# Altium project STM8L151K-EVAL.PrjPcb
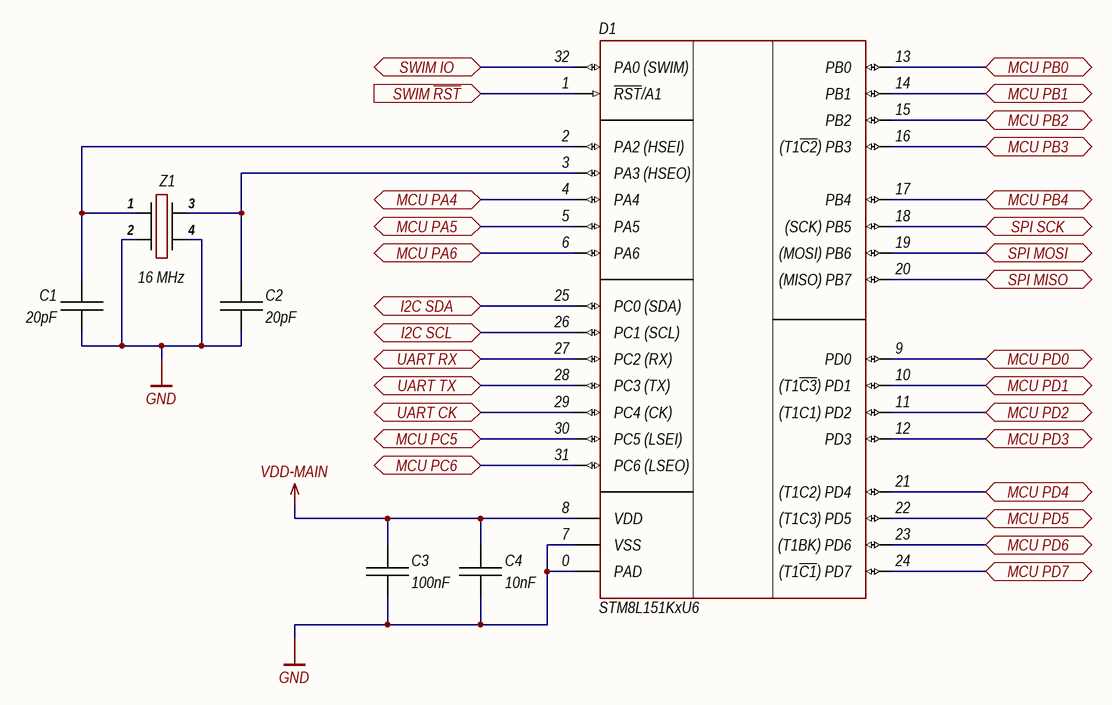
[diagram p0: MCU.SchDoc]
ProjectTitle: Evaluation board for MCU STM8L151; ProjectShortDate: 2019.02; ProjectRevision: 201; ProjectNumber: STM8L151K-EVAL; ProjectDate: 01.02.2019; ProjectCompanyName: Azek Clark © 2021; ProjectAuthor: Clark A.
7 sheets, 28 parts. Net scope: flat (ports and power ports of the same name join across sheets).
Board file: PCB.PcbDoc
Sheets:
  MCU.SchDoc
  Connector-side-1.SchDoc
  Connector-side-2.SchDoc
  Connector-side-3.SchDoc
  Connector-SWIM.SchDoc
  Board-user.SchDoc
  Board-powersupply.SchDoc

## Sheet MCU.SchDoc: =ProjectTitle
size 297 x 209 mm; Author: Clark A.; CompanyName: Azek Clark © 2021; Address1: Address1; Address2: Address2; Address3: Address3; Address4: Address4; DocumentNumber: STM8L151K-EVAL 201; SheetNumber: 1; SheetTotal: 6; Scale: 1:1; DocumentType: Схема электрическая принципиальная; FirstReferrence: STM8L151K-EVAL; Title2str: ?

### Parts
C1  20pF  [CH0402C]
C2  20pF  [CH0402C]
C3  100nF  [CH0402C]
C4  10nF  [CH0402C]
D1  STM8L151KxU6  [32-UFQFPN]
Z1  16 MHz  [OSC: 3225]

### Ports
I2C SCL (bidir), I2C SDA (bidir), MCU PA4 (bidir), MCU PA5 (bidir), MCU PA6 (bidir), MCU PB0 (bidir), MCU PB1 (bidir), MCU PB2 (bidir), MCU PB3 (bidir), MCU PB4 (bidir), MCU PC5 (bidir), MCU PC6 (bidir), MCU PD0 (bidir), MCU PD1 (bidir), MCU PD2 (bidir), MCU PD3 (bidir), MCU PD4 (bidir), MCU PD5 (bidir), MCU PD6 (bidir), MCU PD7 (bidir), SPI MISO (bidir), SPI MOSI (bidir), SPI SCK (bidir), SWIM IO (bidir), SWIM ~{RST} (in), UART CK (bidir), UART RX (bidir), UART TX (bidir)

### Nets
GND: C1.1 C2.1 C3.1 C4.1 D1.0(PAD) D1.7(VSS) Z1.2 Z1.4
VDD-MAIN: C3.2 C4.2 D1.8(VDD)
I2C SCL: D1.26(PC1_(SCL)) ; port I2C SCL
I2C SDA: D1.25(PC0_(SDA)) ; port I2C SDA
MCU PA4: D1.4(PA4) ; port MCU PA4
MCU PA5: D1.5(PA5) ; port MCU PA5
MCU PA6: D1.6(PA6) ; port MCU PA6
MCU PB0: D1.13(PB0) ; port MCU PB0
MCU PB1: D1.14(PB1) ; port MCU PB1
MCU PB2: D1.15(PB2) ; port MCU PB2
MCU PB3: D1.16((T1~{C2})_PB3) ; port MCU PB3
MCU PB4: D1.17(PB4) ; port MCU PB4
MCU PC5: D1.30(PC5_(LSEI)) ; port MCU PC5
MCU PC6: D1.31(PC6_(LSEO)) ; port MCU PC6
MCU PD0: D1.9(PD0) ; port MCU PD0
MCU PD1: D1.10((T1~{C3})_PD1) ; port MCU PD1
MCU PD2: D1.11((T1C1)_PD2) ; port MCU PD2
MCU PD3: D1.12(PD3) ; port MCU PD3
MCU PD4: D1.21((T1C2)_PD4) ; port MCU PD4
MCU PD5: D1.22((T1C3)_PD5) ; port MCU PD5
MCU PD6: D1.23((T1BK)_PD6) ; port MCU PD6
MCU PD7: D1.24((T1~{C1})_PD7) ; port MCU PD7
SPI MISO: D1.20((MISO)_PB7) ; port SPI MISO
SPI MOSI: D1.19((MOSI)_PB6) ; port SPI MOSI
SPI SCK: D1.18((SCK)_PB5) ; port SPI SCK
SWIM IO: D1.32(PA0_(SWIM)) ; port SWIM IO
SWIM ~{RST}: D1.1(~{RST}/A1) ; port SWIM ~{RST}
UART CK: D1.29(PC4_(CK)) ; port UART CK
UART RX: D1.27(PC2_(RX)) ; port UART RX
UART TX: D1.28(PC3_(TX)) ; port UART TX
NetC1_2: C1.2 D1.2(PA2_(HSEI)) Z1.1
NetC2_2: C2.2 D1.3(PA3_(HSEO)) Z1.3

### Notes on the sheet
- Утв.
- Н.контр.
- Т.контр.
- Пров.
- Разраб.
- Изм.
- Лист
- № докум.
- Подп.
- Дата
- Копировал
- Формат А4
- Лит.
- Листов
- Масса
- Масштаб

### Library data of the parts
C1 C2 = Capacitor: Manufacturer: YAGEO; Model: CC0402JRNPO9BN200; HelpURL: https://lcsc.com/product-detail/Multilayer-Ceramic-Capacitors-MLCC-SMD-SMT_YAGEO-CC0402JRNPO9BN200_C107000.html; ComponentKind: NP0, 50V; Value: 20pF
C3 = Capacitor: Manufacturer: CCTC; Model: TCC0402X7R104K250AT; HelpURL: https://lcsc.com/product-detail/Multilayer-Ceramic-Capacitors-MLCC-SMD-SMT_CCTC-TCC0402X7R104K250AT_C466234.html; ComponentKind: X7R, 50V; Value: 100nF
C4 = Capacitor: Manufacturer: CCTC; Model: TCC0402X7R103M500AT; HelpURL: https://lcsc.com/product-detail/Multilayer-Ceramic-Capacitors-MLCC-SMD-SMT_CCTC-TCC0402X7R103M500AT_C696856.html; ComponentKind: X7R, 50V; Value: 10nF
D1 = STM8L151KxU6: STM8; Manufacturer: ST Microelectronics; Model: STM8L151KxU6; ComponentKind: 1.8-3.6V, UFQFPN32; HelpURL: https://ru.mouser.com/datasheet/2/389/stm8l151c4-956418.pdf
Z1 = Generator: Manufacturer: JWT; Model: JF4016M00020T8188090; HelpURL: https://lcsc.com/product-detail/SMD-Crystal-Resonators_JWT-JF4016M00020T8188090_C726643.html; ComponentKind: ±10ppm 20pF 60Ω; Value: 16 MHz

## Sheet Connector-side-1.SchDoc: =ProjectTitle
size 297 x 209 mm; Author: Clark A.; CompanyName: Azek Clark © 2021; Address1: Address1; Address2: Address2; Address3: Address3; Address4: Address4; DocumentNumber: STM8L151K-EVAL 201; SheetNumber: 2; SheetTotal: 6; Scale: 1:1; DocumentType: Схема электрическая принципиальная; FirstReferrence: STM8L151K-EVAL
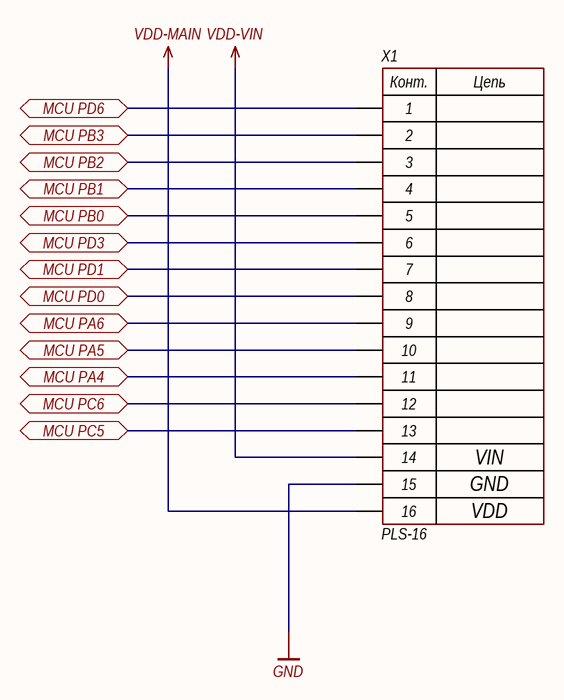
[diagram p1: Connector-side-1.SchDoc]

### Parts
X1  PLS-16  [CON: PLS-16]

### Ports
MCU PA4 (bidir), MCU PA5 (bidir), MCU PA6 (bidir), MCU PB0 (bidir), MCU PB1 (bidir), MCU PB2 (bidir), MCU PB3 (bidir), MCU PC5 (bidir), MCU PC6 (bidir), MCU PD0 (bidir), MCU PD1 (bidir), MCU PD3 (bidir), MCU PD6 (bidir)

### Nets
GND: X1.15
VDD-MAIN: X1.16
VDD-VIN: X1.14
MCU PA4: X1.11 ; port MCU PA4
MCU PA5: X1.10 ; port MCU PA5
MCU PA6: X1.9 ; port MCU PA6
MCU PB0: X1.5 ; port MCU PB0
MCU PB1: X1.4 ; port MCU PB1
MCU PB2: X1.3 ; port MCU PB2
MCU PB3: X1.2 ; port MCU PB3
MCU PC5: X1.13 ; port MCU PC5
MCU PC6: X1.12 ; port MCU PC6
MCU PD0: X1.8 ; port MCU PD0
MCU PD1: X1.7 ; port MCU PD1
MCU PD3: X1.6 ; port MCU PD3
MCU PD6: X1.1 ; port MCU PD6

### Notes on the sheet
- VIN
- GND
- VDD
- Изм.
- Лист
- № докум.
- Подп.
- Дата
- Копировал
- Формат А4
- (in symbol 16-Connector) Конт.; Цепь

### Library data of the parts
X1 = 16-Connector: Model: PLS-16; Manufacturer: *; HelpURL: *; ComponentKind: *

## Sheet Connector-side-2.SchDoc: =ProjectTitle
size 297 x 209 mm; Author: Clark A.; CompanyName: Azek Clark © 2021; Address1: Address1; Address2: Address2; Address3: Address3; Address4: Address4; DocumentNumber: STM8L151K-EVAL 201; SheetNumber: 3; SheetTotal: 6; Scale: 1:1; DocumentType: Схема электрическая принципиальная; FirstReferrence: STM8L151K-EVAL
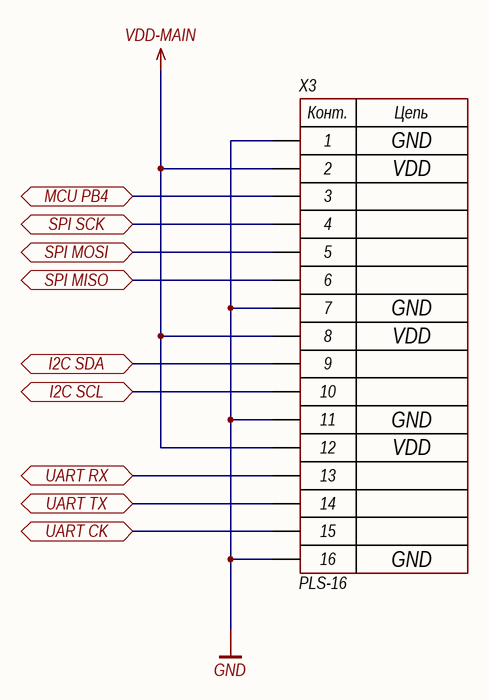
[diagram p2: Connector-side-2.SchDoc]

### Parts
X3  PLS-16  [CON: PLS-16]

### Ports
I2C SCL (bidir), I2C SDA (bidir), MCU PB4 (bidir), SPI MISO (bidir), SPI MOSI (bidir), SPI SCK (bidir), UART CK (bidir), UART RX (bidir), UART TX (bidir)

### Nets
GND: X3.1 X3.7 X3.11 X3.16
VDD-MAIN: X3.2 X3.8 X3.12
I2C SCL: X3.10 ; port I2C SCL
I2C SDA: X3.9 ; port I2C SDA
MCU PB4: X3.3 ; port MCU PB4
SPI MISO: X3.6 ; port SPI MISO
SPI MOSI: X3.5 ; port SPI MOSI
SPI SCK: X3.4 ; port SPI SCK
UART CK: X3.15 ; port UART CK
UART RX: X3.13 ; port UART RX
UART TX: X3.14 ; port UART TX

### Notes on the sheet
- GND
- VDD
- Изм.
- Лист
- № докум.
- Подп.
- Дата
- Копировал
- Формат А4
- (in symbol 16-Connector) Конт.; Цепь

### Library data of the parts
X3 = 16-Connector: Model: PLS-16; Manufacturer: *; HelpURL: *; ComponentKind: *

## Sheet Connector-side-3.SchDoc: =ProjectTitle
size 297 x 209 mm; Author: Clark A.; CompanyName: Azek Clark © 2021; Address1: Address1; Address2: Address2; Address3: Address3; Address4: Address4; DocumentNumber: STM8L151K-EVAL 201; SheetNumber: ?; SheetTotal: ?; Scale: 1:1; DocumentType: Схема электрическая принципиальная; FirstReferrence: STM8L151K-EVAL
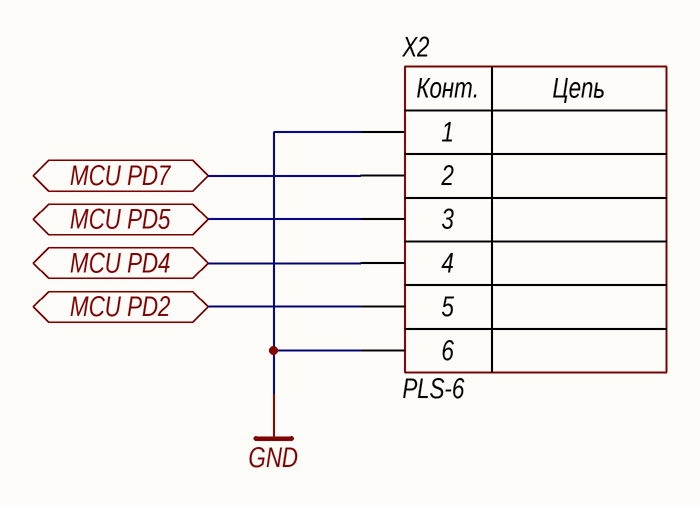
[diagram p3: Connector-side-3.SchDoc]

### Parts
X2  PLS-6  [CON: PLS-6]

### Ports
MCU PD2 (bidir), MCU PD4 (bidir), MCU PD5 (bidir), MCU PD7 (bidir)

### Nets
GND: X2.1 X2.6
MCU PD2: X2.5 ; port MCU PD2
MCU PD4: X2.4 ; port MCU PD4
MCU PD5: X2.3 ; port MCU PD5
MCU PD7: X2.2 ; port MCU PD7

### Notes on the sheet
- Изм.
- Лист
- № докум.
- Подп.
- Дата
- Копировал
- Формат А4
- (in symbol 6-Connector) Конт.; Цепь

### Library data of the parts
X2 = 6-Connector: Model: PLS-6; Manufacturer: *; HelpURL: *; ComponentKind: *

## Sheet Connector-SWIM.SchDoc: =ProjectTitle
size 297 x 209 mm; Author: Clark A.; CompanyName: Azek Clark © 2021; Address1: Address1; Address2: Address2; Address3: Address3; Address4: Address4; DocumentNumber: STM8L151K-EVAL 201; SheetNumber: 4; SheetTotal: 6; Scale: 1:1; DocumentType: Схема электрическая принципиальная; FirstReferrence: STM8L151K-EVAL
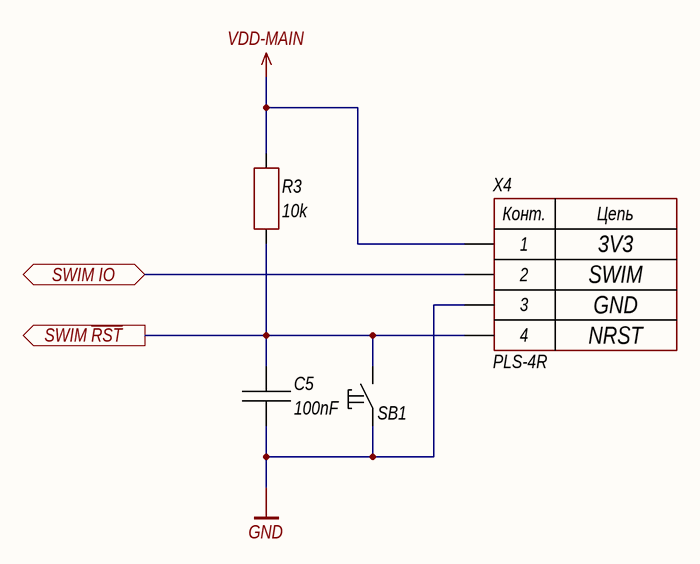
[diagram p4: Connector-SWIM.SchDoc]

### Parts
C5  100nF  [CH0402C]
R3  10k  [CH0402R]
SB1  "Кнопка"  [BUT: YTS-A017]  (value not drawn)
X4  PLS-4R  [CON: PLS-4]

### Ports
SWIM IO (bidir), SWIM ~{RST} (out)

### Nets
GND: C5.1 SB1.1 X4.3
VDD-MAIN: R3.2 X4.1
SWIM IO: X4.2 ; port SWIM IO
SWIM ~{RST}: C5.2 R3.1 SB1.2 X4.4 ; port SWIM ~{RST}

### Notes on the sheet
- 3V3
- GND
- SWIM
- NRST
- Изм.
- Лист
- № докум.
- Подп.
- Дата
- Копировал
- Формат А4
- (in symbol 4-Connector) Конт.; Цепь

### Library data of the parts
C5 = Capacitor: as C3 on sheet MCU; HelpURL: https://lcsc.com/product-detail/Multilayer-Ceramic-Capacitors-MLCC-SMD-SMT_CCTC-TCC0402X7R104K250AT_C466234.html; ComponentKind: X7R, 50V; Value: 100nF
R3 = Resistor: Manufacturer: Uniroyal Elec; Model: 0402WGF1002TCE; HelpURL: https://lcsc.com/product-detail/Chip-Resistor-Surface-Mount_UNI-ROYAL-Uniroyal-Elec-0402WGF1002TCE_C25744.html; ComponentKind: ±1%; Value: 10k
SB1 = Tactile switches: 6x6 mm; Manufacturer: DGBZ; Model: YTSA017A0252501B; HelpURL: https://lcsc.com/product-detail/Tactile-Switches_DGBZ-YTSA017A0252501B_C967796.html; ComponentKind: SMT Tactile switch
X4 = 4-Connector: Model: PLS-4R; Manufacturer: *; HelpURL: *; ComponentKind: *

## Sheet Board-user.SchDoc: =ProjectTitle
size 297 x 209 mm; Author: Clark A.; CompanyName: Azek Clark © 2021; Address1: Address1; Address2: Address2; Address3: Address3; Address4: Address4; DocumentNumber: STM8L151K-EVAL 201; SheetNumber: 5; SheetTotal: 6; Scale: 1:1; DocumentType: Схема электрическая принципиальная; FirstReferrence: STM8L151K-EVAL
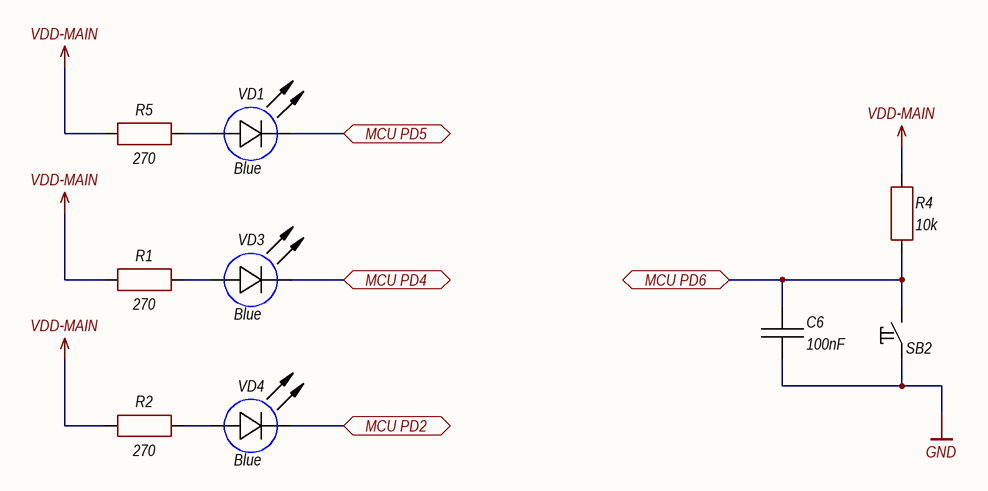
[diagram p5: Board-user.SchDoc]

### Parts
C6  100nF  [CH0402C]
R1  270  [CH0402R]
R2  270  [CH0402R]
R4  10k  [CH0402R]
R5  270  [CH0402R]
SB2  "Кнопка"  [BUT: YTS-A017]  (value not drawn)
VD1  Blue  [CH0402LB]
VD3  Blue  [CH0402LB]
VD4  Blue  [CH0402LB]

### Ports
MCU PD2 (bidir), MCU PD4 (bidir), MCU PD5 (bidir), MCU PD6 (bidir)

### Nets
GND: C6.1 SB2.1
VDD-MAIN: R1.1 R2.1 R4.1 R5.1
MCU PD2: VD4.2(C) ; port MCU PD2
MCU PD4: VD3.2(C) ; port MCU PD4
MCU PD5: VD1.2(C) ; port MCU PD5
MCU PD6: C6.2 R4.2 SB2.2 ; port MCU PD6
NetR1_2: R1.2 VD3.1(A)
NetR2_2: R2.2 VD4.1(A)
NetR5_2: R5.2 VD1.1(A)

### Notes on the sheet
- Изм.
- Лист
- № докум.
- Подп.
- Дата
- Копировал
- Формат А4

### Library data of the parts
C6 = Capacitor: as C3 on sheet MCU; HelpURL: https://lcsc.com/product-detail/Multilayer-Ceramic-Capacitors-MLCC-SMD-SMT_CCTC-TCC0402X7R104K250AT_C466234.html; ComponentKind: X7R, 50V; Value: 100nF
R1 R2 R5 = Resistor: Manufacturer: YAGEO; Model: AC0402FR-07270RL; HelpURL: https://lcsc.com/product-detail/Chip-Resistor-Surface-Mount_YAGEO-AC0402FR-07270RL_C138294.html; ComponentKind: 0402 resistor; Value: 270
R4 = Resistor: Manufacturer: UNI-ROYAL(Uniroyal Elec); Model: 0402WGF1003TCE; HelpURL: https://lcsc.com/product-detail/Chip-Resistor-Surface-Mount_UNI-ROYAL-Uniroyal-Elec-0402WGF1003TCE_C25741.html; ComponentKind: 0402 resistor ±1%; Value: 10k
SB2 = Tactile switches: as SB1 on sheet Connector-SWIM; HelpURL: https://lcsc.com/product-detail/Tactile-Switches_DGBZ-YTSA017A0252501B_C967796.html; ComponentKind: SMT Tactile switch
VD1 VD3 VD4 = LED: Manufacturer: XINGLIGHT; Model: XL-1005UBC; HelpURL: https://lcsc.com/product-detail/Pre-ordered-Products_XINGLIGHT-XL-1005UBC_C965795.html; ComponentKind: Blue led, 2.8V, 5mA; Value: Blue

## Sheet Board-powersupply.SchDoc: =ProjectTitle
size 297 x 209 mm; Author: Clark A.; CompanyName: Azek Clark © 2021; Address1: Address1; Address2: Address2; Address3: Address3; Address4: Address4; DocumentNumber: STM8L151K-EVAL 201; SheetNumber: 6; SheetTotal: 6; Scale: 1:1; DocumentType: Схема электрическая принципиальная; FirstReferrence: STM8L151K-EVAL
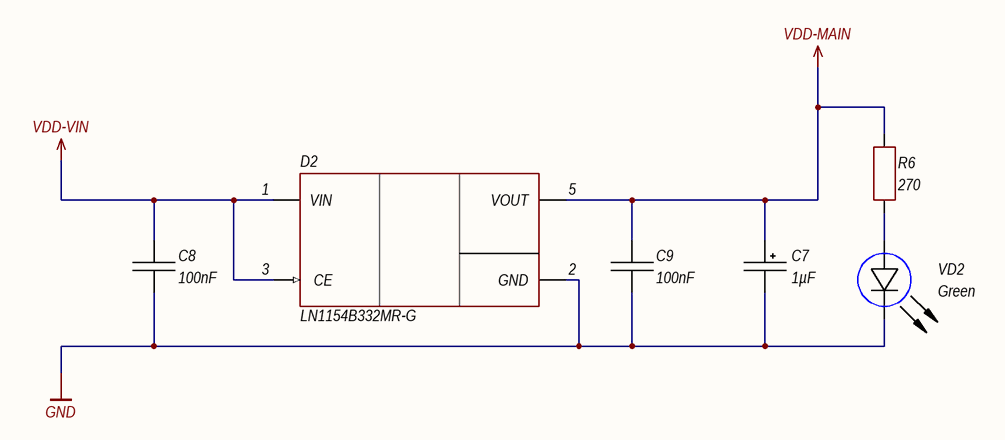
[diagram p6: Board-powersupply.SchDoc]

### Parts
C7  1µF  [TANTAL_A]
C8  100nF  [CH0603CM]
C9  100nF  [CH0603CM]
D2  LN1154B332MR-G  [SOT23-5]
R6  270  [CH0402R]
VD2  Green  [CH0402LG]

### Nets
GND: C7.2 C8.1 C9.1 D2.2(GND) VD2.2(C)
VDD-MAIN: C7.1 C9.2 D2.5(VOUT) R6.1
VDD-VIN: C8.2 D2.1(VIN) D2.3(CE)
NetR6_2: R6.2 VD2.1(A)

### Notes on the sheet
- Изм.
- Лист
- № докум.
- Подп.
- Дата
- Копировал
- Формат А4

### Library data of the parts
C7 = TantalCap: Manufacturer: *; Model: *; HelpURL: *; ComponentKind: *; Value: 1µF
C8 C9 = Capacitor: as C3 on sheet MCU; HelpURL: https://lcsc.com/product-detail/Multilayer-Ceramic-Capacitors-MLCC-SMD-SMT_CCTC-TCC0402X7R104K250AT_C466234.html; ComponentKind: X7R, 50V; Value: 100nF
D2 = LN1154: LDO; Manufacturer: NATLINEAR; Model: LN1154B332MR-G; HelpURL: https://lcsc.com/product-detail/Dropout-Regulators-LDO_NATLINEAR-LN1154B332MR-G_C236379.html; ComponentKind: SOT-23-5, 300mA, Vin: 2-7V
R6 = Resistor: as R1 on sheet Board-user; HelpURL: https://lcsc.com/product-detail/Chip-Resistor-Surface-Mount_YAGEO-AC0402FR-07270RL_C138294.html; ComponentKind: 0402 resistor; Value: 270
VD2 = LED: Manufacturer: XINGLIGHT; Model: XL-1005UGC; HelpURL: https://lcsc.com/product-detail/Light-Emitting-Diodes-LED_XINGLIGHT-XL-1005UGC_C965793.html; ComponentKind: Green led, 2.8V, 5mA; Value: Green

## Nets that join several sheets
GND: MCU (8 pins), Connector-side-1 (X1.15), Connector-side-2 (X3.1 X3.7 X3.11 X3.16), Connector-side-3 (X2.1 X2.6), Connector-SWIM (C5.1 SB1.1 X4.3), Board-user (C6.1 SB2.1), Board-powersupply (5 pins)
VDD-MAIN: MCU (C3.2 C4.2 D1.8), Connector-side-1 (X1.16), Connector-side-2 (X3.2 X3.8 X3.12), Connector-SWIM (R3.2 X4.1), Board-user (R1.1 R2.1 R4.1 R5.1), Board-powersupply (C7.1 C9.2 D2.5 R6.1)
VDD-VIN: Connector-side-1 (X1.14), Board-powersupply (C8.2 D2.1 D2.3)
I2C SCL: MCU (D1.26), Connector-side-2 (X3.10)
I2C SDA: MCU (D1.25), Connector-side-2 (X3.9)
MCU PA4: MCU (D1.4), Connector-side-1 (X1.11)
MCU PA5: MCU (D1.5), Connector-side-1 (X1.10)
MCU PA6: MCU (D1.6), Connector-side-1 (X1.9)
MCU PB0: MCU (D1.13), Connector-side-1 (X1.5)
MCU PB1: MCU (D1.14), Connector-side-1 (X1.4)
MCU PB2: MCU (D1.15), Connector-side-1 (X1.3)
MCU PB3: MCU (D1.16), Connector-side-1 (X1.2)
MCU PB4: MCU (D1.17), Connector-side-2 (X3.3)
MCU PC5: MCU (D1.30), Connector-side-1 (X1.13)
MCU PC6: MCU (D1.31), Connector-side-1 (X1.12)
MCU PD0: MCU (D1.9), Connector-side-1 (X1.8)
MCU PD1: MCU (D1.10), Connector-side-1 (X1.7)
MCU PD2: MCU (D1.11), Connector-side-3 (X2.5), Board-user (VD4.2)
MCU PD3: MCU (D1.12), Connector-side-1 (X1.6)
MCU PD4: MCU (D1.21), Connector-side-3 (X2.4), Board-user (VD3.2)
MCU PD5: MCU (D1.22), Connector-side-3 (X2.3), Board-user (VD1.2)
MCU PD6: MCU (D1.23), Connector-side-1 (X1.1), Board-user (C6.2 R4.2 SB2.2)
MCU PD7: MCU (D1.24), Connector-side-3 (X2.2)
SPI MISO: MCU (D1.20), Connector-side-2 (X3.6)
SPI MOSI: MCU (D1.19), Connector-side-2 (X3.5)
SPI SCK: MCU (D1.18), Connector-side-2 (X3.4)
SWIM IO: MCU (D1.32), Connector-SWIM (X4.2)
SWIM ~{RST}: MCU (D1.1), Connector-SWIM (C5.2 R3.1 SB1.2 X4.4)
UART CK: MCU (D1.29), Connector-side-2 (X3.15)
UART RX: MCU (D1.27), Connector-side-2 (X3.13)
UART TX: MCU (D1.28), Connector-side-2 (X3.14)